# EAGLE schematic blt (EAGLE 7.2.0)
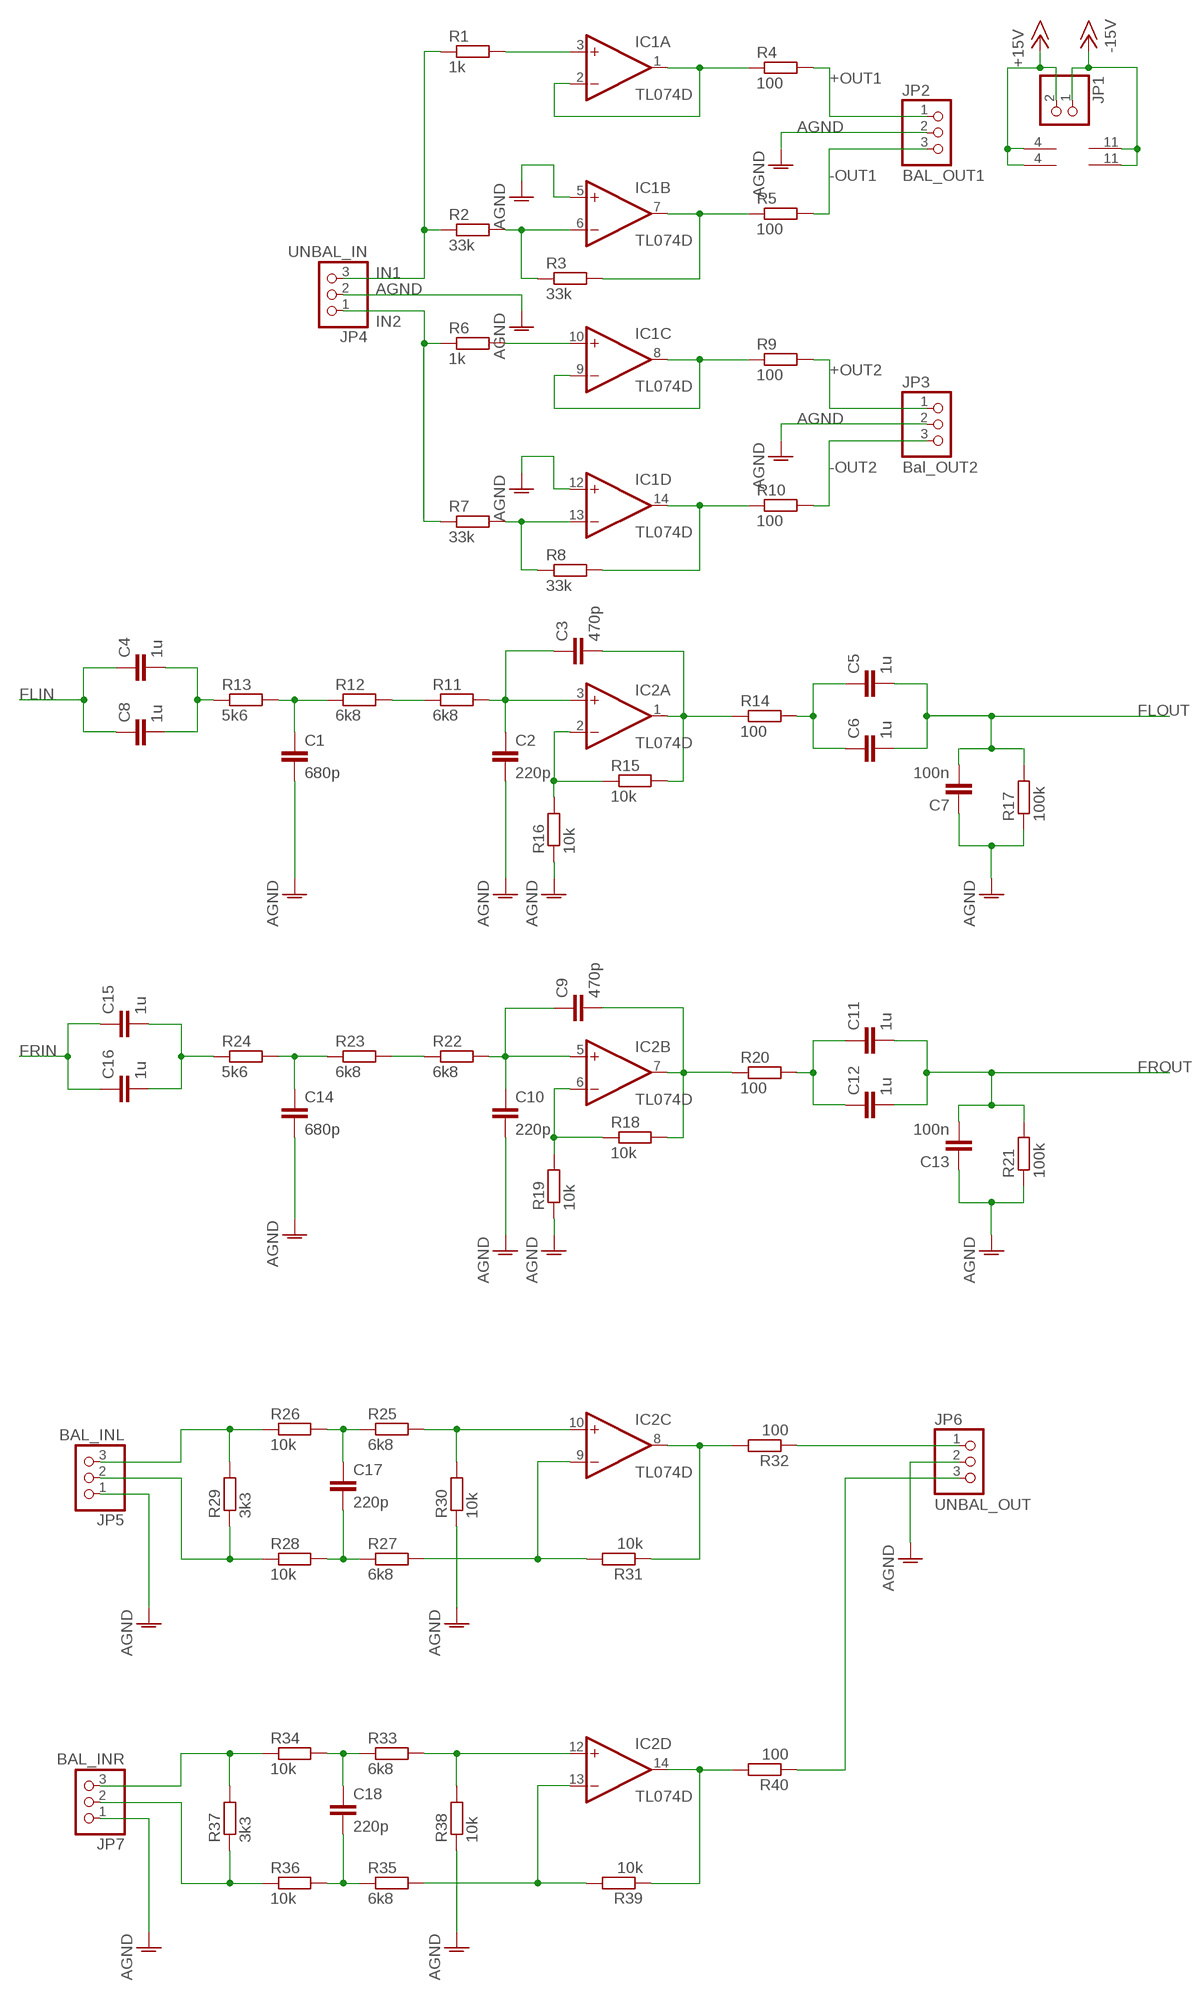
[diagram p0: schematic, sheet 1]

## Parts
C1  680p  C-EUC1206  [C1206]
C2  220p  C-EUC1206  [C1206]
C3  470p  C-EUC1206  [C1206]
C4  1u  C-EUC0805  [C0805]
C5  1u  C-EUC0805  [C0805]
C6  1u  C-EUC0805  [C0805]
C7  100n  C-EUC0805  [C0805]
C8  1u  C-EUC0805  [C0805]
C9  470p  C-EUC1206  [C1206]
C10  220p  C-EUC1206  [C1206]
C11  1u  C-EUC0805  [C0805]
C12  1u  C-EUC0805  [C0805]
C13  100n  C-EUC0805  [C0805]
C14  680p  C-EUC1206  [C1206]
C15  1u  C-EUC0805  [C0805]
C16  1u  C-EUC0805  [C0805]
C17  220p  C-EUC1206  [C1206]
C18  220p  C-EUC1206  [C1206]
IC1  TL074D  [SO14]
IC2  TL074D  [SO14]
JP1  PINHD-1X2  [1X02]
JP2  BAL_OUT1  PINHD-1X3  [1X03]
JP3  Bal_OUT2  PINHD-1X3  [1X03]
JP4  UNBAL_IN  PINHD-1X3  [1X03]
JP5  BAL_INL  PINHD-1X3  [1X03]
JP6  UNBAL_OUT  PINHD-1X3  [1X03]
JP7  BAL_INR  PINHD-1X3  [1X03]
R1  1k  R-EU_R1206  [R1206]
R2  33k  R-EU_R1206  [R1206]
R3  33k  R-EU_R1206  [R1206]
R4  100  R-EU_R1206  [R1206]
R5  100  R-EU_R1206  [R1206]
R6  1k  R-EU_R1206  [R1206]
R7  33k  R-EU_R1206  [R1206]
R8  33k  R-EU_R1206  [R1206]
R9  100  R-EU_R1206  [R1206]
R10  100  R-EU_R1206  [R1206]
R11  6k8  R-EU_R1206  [R1206]
R12  6k8  R-EU_R1206  [R1206]
R13  5k6  R-EU_R1206  [R1206]
R14  100  R-EU_R1206  [R1206]
R15  10k  R-EU_R1206  [R1206]
R16  10k  R-EU_R1206  [R1206]
R17  100k  R-EU_R1206  [R1206]
R18  10k  R-EU_R1206  [R1206]
R19  10k  R-EU_R1206  [R1206]
R20  100  R-EU_R1206  [R1206]
R21  100k  R-EU_R1206  [R1206]
R22  6k8  R-EU_R1206  [R1206]
R23  6k8  R-EU_R1206  [R1206]
R24  5k6  R-EU_R1206  [R1206]
R25  6k8  R-EU_R1206  [R1206]
R26  10k  R-EU_R1206  [R1206]
R27  6k8  R-EU_R1206  [R1206]
R28  10k  R-EU_R1206  [R1206]
R29  3k3  R-EU_R1206  [R1206]
R30  10k  R-EU_R1206  [R1206]
R31  10k  R-EU_R1206  [R1206]
R32  100  R-EU_R1206  [R1206]
R33  6k8  R-EU_R1206  [R1206]
R34  10k  R-EU_R1206  [R1206]
R35  6k8  R-EU_R1206  [R1206]
R36  10k  R-EU_R1206  [R1206]
R37  3k3  R-EU_R1206  [R1206]
R38  10k  R-EU_R1206  [R1206]
R39  10k  R-EU_R1206  [R1206]
R40  100  R-EU_R1206  [R1206]

## Nets
+15V: IC1.4(P:V+) IC2.4(P:V+) JP1.2
+OUT1: JP2.1 R4.2
+OUT2: JP3.1 R9.2
-15V: IC1.11(P:V-) IC2.11(P:V-) JP1.1
-OUT1: JP2.3 R5.2
-OUT2: JP3.3 R10.2
AGND: C1.2 C2.2 C7.1 C10.2 C13.1 C14.2 IC1.5(B:+IN) IC1.12(D:+IN) JP2.2 JP3.2 JP4.2 JP5.1 JP6.2 JP7.1 R16.1 R17.1 R19.1 R21.1 R30.1 R38.1
FLIN: C4.1 C8.1
FLOUT: C5.2 C6.2 C7.2 R17.2
FRIN: C15.1 C16.1
FROUT: C11.2 C12.2 C13.2 R21.2
IN1: JP4.3 R1.1 R2.1
IN2: JP4.1 R6.1 R7.1
N$1: IC1.3(A:+IN) R1.2
N$2: IC1.6(B:-IN) R2.2 R3.1
N$3: IC1.1(A:OUT) IC1.2(A:-IN) R4.1
N$4: R11.1 R12.2
N$5: C2.1 C3.1 IC2.3(A:+IN) R11.2
N$6: IC1.7(B:OUT) R3.2 R5.1
N$7: IC1.10(C:+IN) R6.2
N$8: IC1.8(C:OUT) IC1.9(C:-IN) R9.1
N$9: C1.1 R12.1 R13.2
N$10: IC1.13(D:-IN) R7.2 R8.1
N$11: IC1.14(D:OUT) R8.2 R10.1
N$12: C3.2 IC2.1(A:OUT) R14.1 R15.2
N$13: IC2.2(A:-IN) R15.1 R16.2
N$14: C5.1 C6.1 R14.2
N$15: C4.2 C8.2 R13.1
N$16: IC2.6(B:-IN) R18.1 R19.2
N$17: C9.2 IC2.7(B:OUT) R18.2 R20.1
N$18: C9.1 C10.1 IC2.5(B:+IN) R22.2
N$19: C11.1 C12.1 R20.2
N$20: R22.1 R23.2
N$21: C14.1 R23.1 R24.2
N$22: C15.2 C16.2 R24.1
N$23: JP5.3 R26.1 R29.2
N$24: JP5.2 R28.1 R29.1
N$25: C17.1 R25.1 R26.2
N$26: C17.2 R27.1 R28.2
N$27: IC2.10(C:+IN) R25.2 R30.2
N$28: IC2.9(C:-IN) R27.2 R31.2
N$29: IC2.8(C:OUT) R31.1 R32.2
N$30: IC2.14(D:OUT) R39.1 R40.2
N$31: JP6.1 R32.1
N$32: JP7.3 R34.1 R37.2
N$33: JP7.2 R36.1 R37.1
N$34: C18.1 R33.1 R34.2
N$35: C18.2 R35.1 R36.2
N$36: IC2.12(D:+IN) R33.2 R38.2
N$37: IC2.13(D:-IN) R35.2 R39.2
N$38: JP6.3 R40.1

## Library data of the parts
C1-C18 = rcl:C-EU: CAPACITOR, European symbol
IC1 IC2 = linear:TL074: OP AMP
JP1 = pinhead:PINHD-1X2: PIN HEADER
JP2-JP7 = pinhead:PINHD-1X3: PIN HEADER
R1-R40 = rcl:R-EU_: RESISTOR, European symbol